# Altium schematic sheet Sheet1.SchDoc (part 2 of 2)
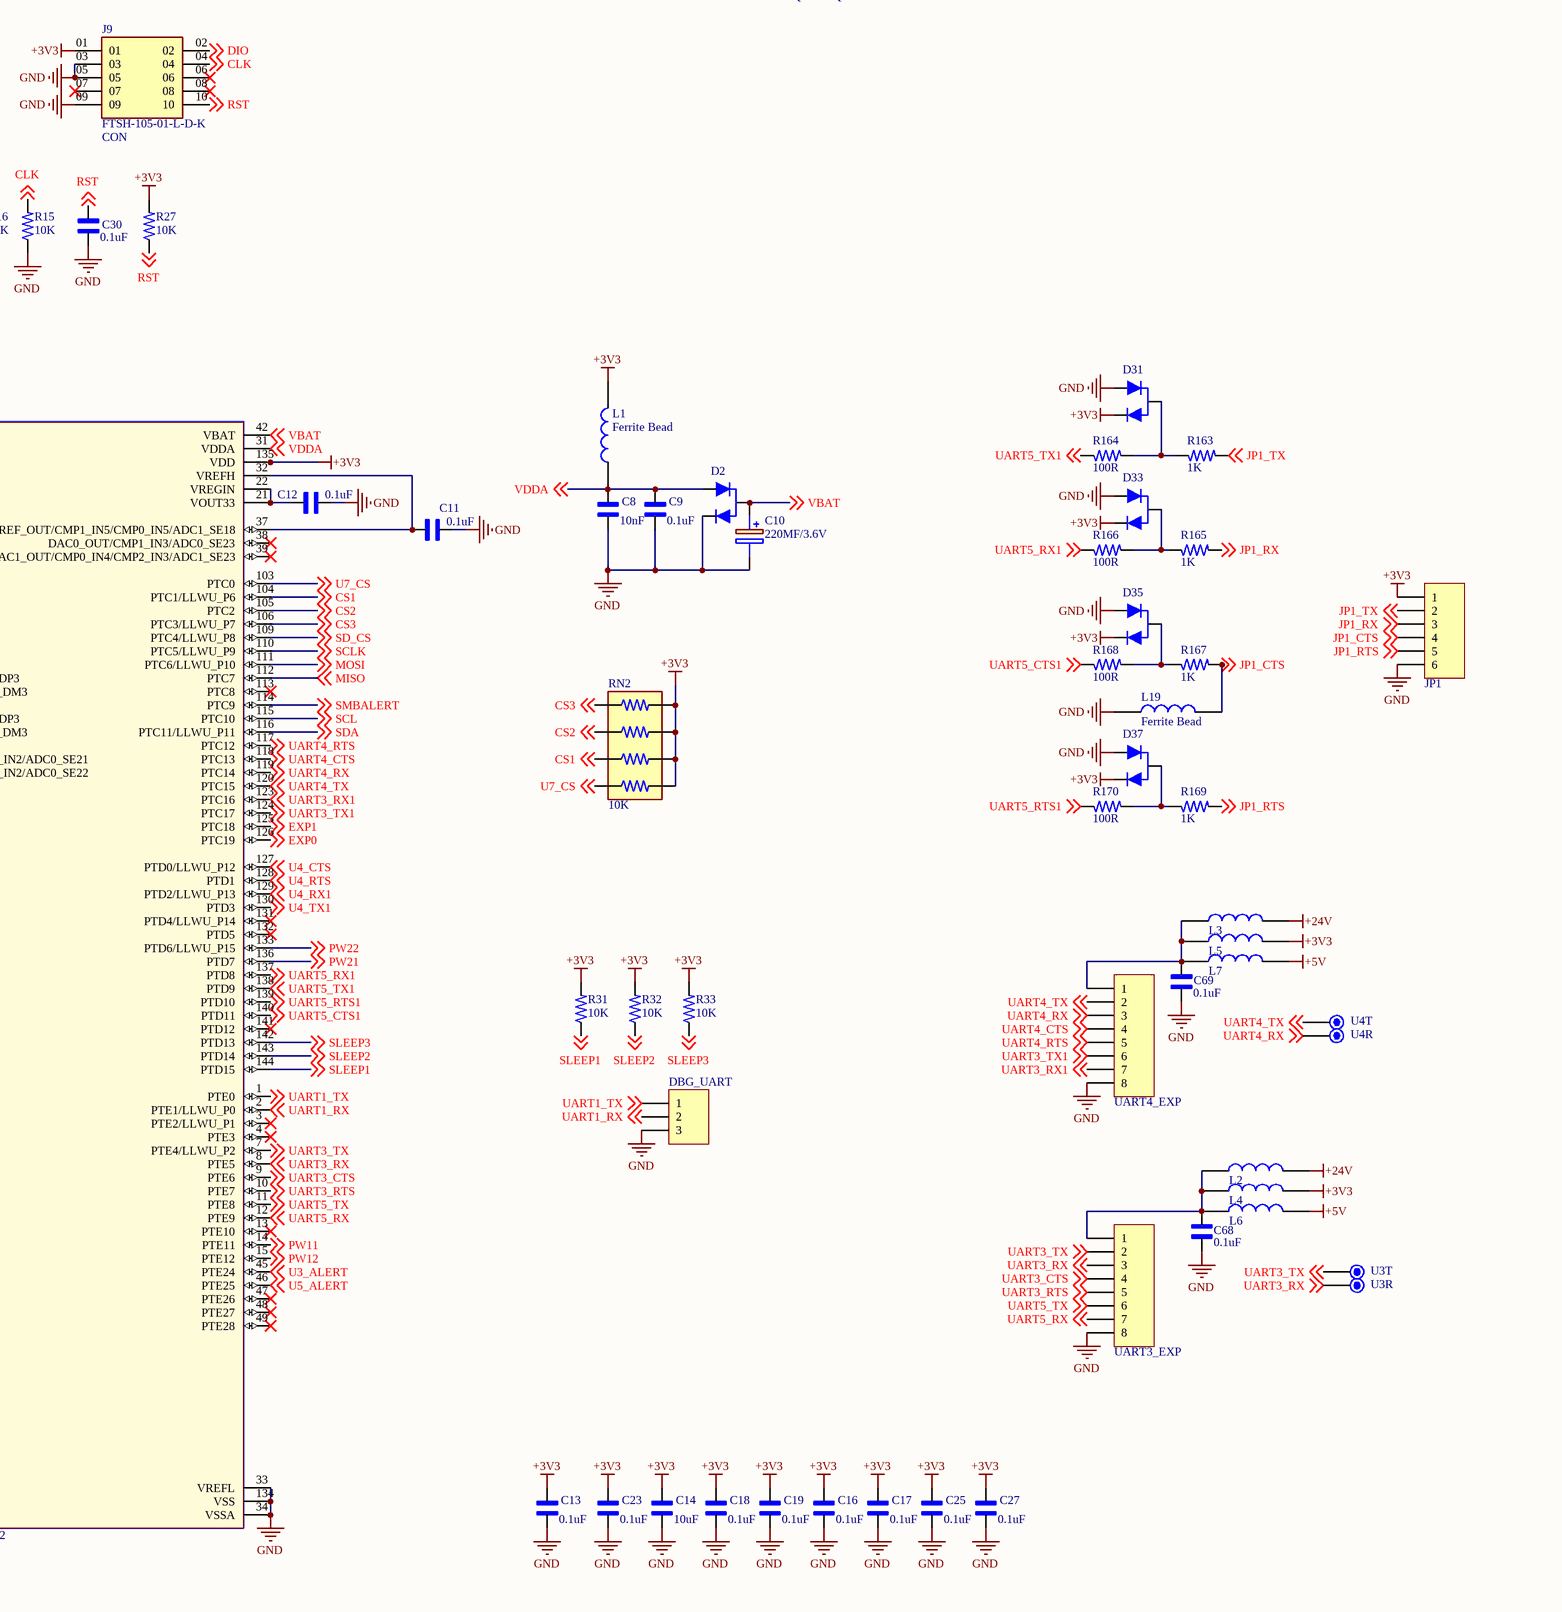
[diagram p6: Sheet1.SchDoc, bottom right]

## Library data of the parts
3V3_IN 5V_IN BUZ P1 P2 = 68000-102HLF: Header, 2-Pin, 2.54mm, male; MF: Amphenol ICC (FCI); Value: 2 pin CON; Datasheet-Link: https://cdn.amphenol-icc.com/media/wysiwyg/files/drawing/68000.pdf?__cf_chl_jschl_tk__=7ea4d2e6d26f4b1af1eb6de445b76fab93bb47dd-1595041825-0-ASnK1FzhPW6vgFI15XYUBUXEwCrSO2dXE6hJ2i7nK7EmHy2IXrw8kXy-yQAUmCnBmIw7fq0tDTrhRSGBjDko3p2cIf_9_6cWkOxKpupqnp2oo8Mh8aWH2eb6ujii_TwFn-8V86_rmivQvUxavIUAiOIBYcm3LlQezqcHHzAaCpgu7miW4qxavRXA3YsY5ejAoH67-z-iVxDQ5Sra6f0EFF9zE8XIxAld420ntFklNg4QF76eftiKB7TEYUxSsn8LfartoqNYBWmHHnD3sc-tmz73YWEHN4X2dyLz7kl35vb2-QvBMSr1BL4MKNiQX7UeGfn1P3DlF5qPDRur16CMA0NTN9g-uagsfIoYsnwBgv65CCZM2V9dKSS6CJzKDs8ifA; DigiKey-Link: https://www.digikey.com.au/product-detail/en/amphenol-icc-fci/68000-102HLF/609-3500-ND/1493545; Datasheet: 68000; DigiKey-PartNum: 609-3500-ND; MP: 68000-102HLF; Price: 0.21
C3-C8 C15 C70-C77 C104 C111 C154 = 08055C103KAT2A: CAP CER 10000PF 50V X7R 0805; MF: AVX Corporation; DigiKey-Link: https://www.digikey.com/en/products/detail/avx-corporation/08055C103KAT2A/563493?s=N4IgTCBcDaIAwA44FZkGECMcDMBpAggCpj4gC6AvkA; MP: 08055C103KAT2A; Datasheet-Link: https://datasheets.avx.com/X7RDielectric.pdf; DigiKey-PartNum: 478-1383-2-ND; Price: 0.1; Datasheet: X7RDielectric.pdf
  C3 C70-C77: Value: ?
C9 C11-C13 C16-C19 C23 C25 C27-C30 C33 C35 C37 C41-C43 C48-C50 C61 C63 C68 C69 C86 C101 C108 C114 C123 C124 C136 C139-C145 C147 C149 C153 C155 = 0805B104K500CT: 0.1µF ±10% 50V Ceramic Capacitor X7R 0805 (2012 Metric); MF: Walsin Technology Corporation; DigiKey-Link: https://www.digikey.com/en/products/detail/walsin-technology-corporation/0805B104K500CT/6707556?s=N4IgTCBcDaIAwA44FYBCBGOAWA0sucAwgCogC6AvkA; MP: 0805B104K500CT; Datasheet-Link: http://www.passivecomponent.com/wp-content/uploads/2018/10/MLCC.pdf; DigiKey-PartNum: 1292-1647-2-ND; Price: 0.12; Datasheet: MLCC.pdf
C10 = EEC-RG0V224H: CAP 220MF -20% +80% 3.6V T/H; MF: Panasonic Electronic Components; Datasheet-Link: https://media.digikey.com/pdf/Data%20Sheets/Panasonic%20Electronic%20Components/RG_Series.pdf; DigiKey-PartNum: P14880-ND; DigiKey-Link: https://www.digikey.com/en/products/detail/panasonic-electronic-components/EEC-RG0V224H/2689238; MP: EEC-RG0V224H; Price: 2.8748; Datasheet: RG_Series.pdf
C14 C34 C105 C125 = GRM21BR61E106KA73L: CAP CER 10UF 25V X5R 0805; MF: Murata Electronics; DigiKey-Link: https://www.digikey.com/en/products/detail/murata-electronics/GRM21BR61E106KA73L/2334874?s=N4IgTCBcDaIOICUCyYCMAhBA2VBRVADFgNICCA7AMwAyIAugL5A; MP: GRM21BR61E106KA73L; Datasheet-Link: https://search.murata.co.jp/Ceramy/image/img/A01X/G101/ENG/GRM21BR61E106KA73-01.pdf; DigiKey-PartNum: 490-5523-2-ND; Price: 0.42; Datasheet: GRM21BR61E106KA73-01.pdf
C20 C24 = 0805N180J500CT: Multilayer Ceramic Capacitors MLCC - SMD/SMT 18pF +-5% 50V; MF: Walsin; DigiKey-Link: https://www.mouser.com/ProductDetail/Walsin/0805N180J500CT?qs=%2Fha2pyFaduikWgGfsiYRtP7oZXvD9xcHAcsFmv7pQ5dIAkGrZOp47g%3D%3D; MP: 0805N180J500CT; Datasheet-Link: https://www.mouser.com/datasheet/2/210/WTC_MLCC_General_Purpose-1534899.pdf; DigiKey-PartNum: 791-0805N180J500CT; Price: 0.1; Datasheet: WTC_MLCC_General_Purpose-1534899.pdf
C21 C22 = 0805N120J500CT: Multilayer Ceramic Capacitors MLCC - SMD/SMT 12pF +-5% 50V; MF: Walsin; DigiKey-Link: https://www.mouser.com/ProductDetail/Walsin/0805N120J500CT?qs=ZrPdAQfJ6DNl6F0w1DXt8g%3D%3D; MP: 0805N120J500CT; Datasheet-Link: https://www.mouser.com/datasheet/2/210/WTC_MLCC_General_Purpose-1534899.pdf; DigiKey-PartNum: 791-0805N120J500CT; Price: 0.1; Datasheet: WTC_MLCC_General_Purpose-1534899.pdf
C38-C40 C106 C109 C110 C126-C135 C146 C148 = GRM32ER71H106KA12L: CAP CER 10UF 50V X7R 1210; MF: Murata Electronics; DigiKey-Link: https://www.digikey.com/en/products/detail/murata-electronics/GRM32ER71H106KA12L/2548481?s=N4IgTCBcDaIOICUCyBmMBRBB2AjACRwAYA2AaQEEcwAZEAXQF8g; MP: GRM32ER71H106KA12L; Datasheet-Link: https://www.murata.com/-/media/webrenewal/support/library/catalog/products/capacitor/ceramiccapacitor/c02e.ashx?la=en-us&cvid=20210120024548000000; DigiKey-PartNum: 490-6544-2-ND; Price: 0.49128; Datasheet: c02e
C44-C47 C51-C55 C121 = 08055C105KAT2A: CAP CER 1UF 50V X7R 0805; MF: AVX Corporation; DigiKey-Link: https://www.digikey.com/en/products/detail/avx-corporation/08055C105KAT2A/3081236?s=N4IgTCBcDaIAwA44FZkGECMKDSBBAKmLiALoC%2BQA; Datasheet-Link: https://datasheets.avx.com/X7RDielectric.pdf; Price: 0.38; MP: 08055C105KAT2A; DigiKey-PartNum: 478-7956-2-ND; Datasheet: X7RDielectric.pdf
C56-C59 C115 C118 = 08055C102KAT4A: CAP CER 1000PF 50V X7R 0805; MF: AVX Corporation; DigiKey-Link: https://www.digikey.com/en/products/detail/avx-corporation/08055C102KAT4A/1635067?s=N4IgTCBcDaIAwA44FZkGECMcwGkCCAKgCx4gC6AvkA; MP: 08055C102KAT4A; Datasheet-Link: https://datasheets.avx.com/X7RDielectric.pdf; DigiKey-PartNum: 08055C102KAT4A-ND; Price: 0.01379; Datasheet: X7RDielectric.pdf
C60 C62 C64-C67 = ESH477M050AH4AA: CAP ALUM 470UF 20% 50V THRU HOLE; MF: KEMET; Datasheet-Link: https://content.kemet.com/datasheets/KEM_A4005_ESH.pdf; DigiKey-PartNum: 399-15683-ND; DigiKey-Link: https://www.digikey.com/en/products/detail/kemet/ESH477M050AH4AA/7423189?s=N4IgTCBcDaIKIGUASAWA7GgsgBgKzYEFUCCQBdAXyA; MP: ESH477M050AH4AA; Price: 0.59; Datasheet: KEM_A4005_ESH.pdf
C107 = VJ0805A101JXAAC: CAP CER 100PF 50V C0G/NP0 0805; MF: Vishay Vitramon; MP: VJ0805A101JXAAC; DigiKey-Link: https://www.digikey.com/en/products/detail/vishay-vitramon/VJ0805A101JXAAC/8306970?s=N4IgTCBcDaIGoCkAMAOJBWAggRidhAGppgMIgC6AvkA; Datasheet-Link: https://www.vishay.com/docs/45199/vjcommercialseries.pdf; DigiKey-PartNum: 720-1840-2-ND; Price: 0.33; Datasheet: vjcommercialseries.pdf
C112 = UMK212B7224KG-T: CAP CER 0.22UF 50V X7R 0805; MF: Taiyo Yuden; DigiKey-Link: https://www.digikey.com/en/products/detail/taiyo-yuden/UMK212B7224KG-T/930639?s=N4IgTCBcDaIKoFkDSYCMYBCB2MYAsSA4gLQAqIAugL5A; Datasheet-Link: https://www.yuden.co.jp/productdata/catalog/mlcc06_e.pdf; Price: 0.15; MP: UMK212B7224KG-T; DigiKey-PartNum: 587-1287-2-ND; Datasheet: mlcc06_e.pdf
C113 C150 = GRM21BR60J226ME39L: CAP CER 22UF 6.3V X5R 0805; MF: Murata Electronics; DigiKey-Link: https://www.digikey.com/en/products/detail/murata-electronics/GRM21BR60J226ME39L/586711?s=N4IgTCBcDaIOICUCyYCMAhBA2ADAKTDCyQFEBmATgBkQBdAXyA; MP: GRM21BR60J226ME39L; Datasheet-Link: https://search.murata.co.jp/Ceramy/image/img/A01X/G101/ENG/GRM21BR60J226ME39-01.pdf; DigiKey-PartNum: 490-1719-2-ND; Price: 0.45; Datasheet: GRM21BR60J226ME39-01.pdf
C116 = CC0805ZRY5V9BB474: CAP CER 0.47UF 50V Y5V 0805; MF: Yageo; DigiKey-Link: https://www.digikey.com/en/products/detail/yageo/CC0805ZRY5V9BB474/5884321?s=N4IgTCBcDaIMJwAwA5EFYBaAlAmmgagJwBCxALAOxkgC6AvkA; Datasheet-Link: https://www.yageo.com/upload/media/product/productsearch/datasheet/mlcc/UPY-GPHC_Y5V_6.3V-to-50V_9.pdf; Price: 0.21; MP: CC0805ZRY5V9BB474; DigiKey-PartNum: 311-4365-2-ND; Datasheet: UPY-GPHC_Y5V_6.3V-to-50V_9.pdf
C117 C122 = VJ0805V334MXACW1BC: CAP CER 0.33UF 50V Y5V 0805; MF: Vishay Vitramon; MP: VJ0805V334MXACW1BC; DigiKey-Link: https://www.digikey.com/en/products/detail/vishay-vitramon/VJ0805V334MXACW1BC/8310675?s=N4IgTCBcDaIGoCkAMAOJBWOBmLAWAsgBoCCAwgOoCMAQqSALoC%2BQA; Datasheet-Link: https://www.vishay.com/docs/28548/vjw1bcbascomseries.pdf; DigiKey-PartNum: VJ0805V334MXACW1BC-ND; Price: 0.17017; Datasheet: vjw1bcbascomseries.pdf
C119 = C1206C104M5RACTU: CAP CER 0.1UF 50V X7R 1206; MF: KEMET; DigiKey-Link: https://www.digikey.com/en/products/detail/kemet/C1206C104M5RACTU/411247?s=N4IgTCBcDaIMIEYwAYBsjkBYCyBWASgIJwAqAqiALoC%2BQA; Price: 0.12; Datasheet-Link: https://content.kemet.com/datasheets/KEM_C1002_X7R_SMD.pdf; MP: C1206C104M5RACTU; Package: 1206 KEMET; DigiKey-PartNum: 399-1248-2-ND; Datasheet: KEM_C1002_X7R_SMD.pdf
C120 = UMK212BB7225KG-T: CAP CER 2.2UF 50V X7R 0805; MF: Taiyo Yuden; DigiKey-Link: https://www.digikey.com/en/products/detail/taiyo-yuden/UMK212BB7225KG-T/3194965?s=N4IgTCBcDaIKoFkDSYCMYBCGDsYwFYkBxAWgBUQBdAXyA; Datasheet-Link: https://www.yuden.co.jp/productdata/catalog/mlcc06_e.pdf; Price: 0.36; MP: UMK212BB7225KG-T; DigiKey-PartNum: 587-3169-2-ND; Datasheet: mlcc06_e.pdf
C137 = 860020675017: CAP ALUM 120UF 20% 50V RADIAL; MF: Würth Elektronik; Datasheet-Link: https://www.we-online.de/katalog/datasheet/860020675017.pdf; DigiKey-PartNum: 732-8863-1-ND; DigiKey-Link: https://www.digikey.com/en/products/detail/w%C3%BCrth-elektronik/860020675017/5728808?s=N4IgTCBcDaIBwDYAMSxIQdgKxIIwZAF0BfIA; MP: 860020675017; Price: 0.35; Datasheet: 860020675017.pdf
C138 = 1206X226K160CT: Multilayer Ceramic Capacitors MLCC - SMD/SMT 1206 MLCC X5R 22 uF +/ -10% 16 V T&R GP; MF: Walsin; DigiKey-Link: https://www.mouser.com/ProductDetail/Walsin/1206X226K160CT?qs=%2Fha2pyFadugVtaQvFA9oTf6iHp56C%252BCWnsDB92qB02DUsEZR1zEjqw%3D%3D; MP: 1206X226K160CT; Datasheet-Link: https://www.mouser.com/datasheet/2/210/WTC_MLCC_General_Purpose-1534899.pdf; DigiKey-PartNum: 791-1206X226K160CT; Price: 0.76; Datasheet: WTC_MLCC_General_Purpose-1534899.pdf
D2 = BAS40-04E6327: BAS40 - HIGH SPEED SWITCHING, CL; MF: Infineon Technologies; Datasheet-Link: https://www.mouser.com/datasheet/2/196/bas40_bas140series-60208.pdf; Value: BAS40-04E6327; DigiKey-PartNum: 2156-BAS40-04E6327-ND; MP: BAS40-04E6327; DigiKey-Link: https://www.digikey.com/en/products/detail/infineon-technologies/BAS40-04E6327/13431907; Price: 0.05; Datasheet: bas40_bas140series-60208.pdf
D3-D6 D15-D22 D31 D33 D35 D37 = BAT54S,215: DIODE ARRAY SCHOTTKY 30V SOT23; MF: Nexperia USA Inc.; Datasheet-Link: https://assets.nexperia.com/documents/data-sheet/BAT54_SER.pdf; Value: BAT54S,215; DigiKey-PartNum: 1727-2904-2-ND; MP: BAT54S,215; DigiKey-Link: https://www.digikey.com/en/products/detail/nexperia-usa-inc/BAT54S-215/763218; Price: 0.13; Datasheet: BAT54_SER.pdf
D7 D8 D23-D26 = BAS40-06: SCHOTTKY SOT-23 40V 0.2A; MF: Diotec Semiconductor; Datasheet-Link: https://diotec.com/tl_files/diotec/files/pdf/datasheets/bas40.pdf; Value: BAS40-06; DigiKey-PartNum: 2796-BAS40-06TR-ND; MP: BAS40-06; DigiKey-Link: https://www.digikey.com/en/products/detail/diotec-semiconductor/BAS40-06/13156765; Price: 0.0319; Datasheet: bas40.pdf
D9-D14 = SMLJ43CA: TVS DIODE 43V 69.4V SMC; MF: Bourns Inc.; Datasheet-Link: https://www.bourns.com/docs/Product-Datasheets/SMLJ.pdf; Value: SMLJ43CA; DigiKey-PartNum: SMLJ43CABTR-ND; MP: SMLJ43CA; DigiKey-Link: https://www.digikey.com/en/products/detail/bourns-inc/SMLJ43CA/2253506; Price: 1.23; Datasheet: SMLJ.pdf
D27 D29 D40 = BZX384-B15,115: DIODE ZENER 15V 300MW SOD323; MF: Nexperia USA Inc.; Datasheet-Link: https://assets.nexperia.com/documents/data-sheet/BZX384_SERIES.pdf; Value: BZX384-B15,115; DigiKey-PartNum: 1727-3640-2-ND; MP: BZX384-B15,115; DigiKey-Link: https://www.digikey.com/en/products/detail/nexperia-usa-inc/BZX384-B15-115/1162898?s=N4IgTCBcDaIEIC0AaBmAHAFgLRwIwFYAaXAkAXQF8g; Price: 0.19; Datasheet: BZX384_SERIES.pdf
D28 D32 = SMAJ43A-E3/61: TVS DIODE 43V 69.4V DO214AC; MF: Vishay General Semiconductor - Diodes Division; Datasheet-Link: https://www.vishay.com/docs/88390/smaj50a.pdf; Value: SMAJ43A-E3/61; DigiKey-PartNum: SMAJ43A-E3/61GITR-ND; MP: SMAJ43A-E3/61; DigiKey-Link: https://www.digikey.com/en/products/detail/vishay-general-semiconductor-diodes-division/SMAJ43A-E3-61/1119136?s=N4IgTCBcDaIMoFkCCApALAZiQWgKIYHoA2ARhAF0BfIA; Price: 0.4; Datasheet: smaj50a.pdf
D30 D36 D38 = 1N4148WS-7-F: Diode Standard 75V 150mA Surface Mount SOD-323; MF: Diodes Incorporated; Datasheet-Link: https://www.diodes.com/assets/Datasheets/ds30097.pdf; Value: 1N4148WS-7-F; DigiKey-PartNum: 1N4148WS-FDITR-ND; MP: 1N4148WS-7-F; DigiKey-Link: https://www.digikey.com.au/product-detail/en/diodes-incorporated/1N4148WS-7-F/1N4148WS-FDITR-ND/815127; Price: 0.03166; Datasheet: ds30097
D34 D39 = MBRD20100CT-13: DIODE SCHOTTKY 100V 10A TO252; MF: Diodes Incorporated; Datasheet-Link: https://www.diodes.com/assets/Datasheets/MBRD20100CT.pdf; Value: MBRD20100CT-13; DigiKey-PartNum: MBRD20100CT-13DITR-ND; MP: MBRD20100CT-13; DigiKey-Link: https://www.digikey.com/en/products/detail/diodes-incorporated/MBRD20100CT-13/5080339?s=N4IgTCBcDaILICEBKARMAGAjO9BhAKgLSYDMIAugL5A; Price: 0.64; Datasheet: MBRD20100CT.pdf
DBG_UART = 68000-103HLF: Header, 3-Pin, 2.54mm, male; MF: Amphenol ICC (FCI); Value: 3pin CON; Datasheet: 68000; Datasheet-Link: https://cdn.amphenol-icc.com/media/wysiwyg/files/drawing/68000.pdf?__cf_chl_jschl_tk__=7ea4d2e6d26f4b1af1eb6de445b76fab93bb47dd-1595041825-0-ASnK1FzhPW6vgFI15XYUBUXEwCrSO2dXE6hJ2i7nK7EmHy2IXrw8kXy-yQAUmCnBmIw7fq0tDTrhRSGBjDko3p2cIf_9_6cWkOxKpupqnp2oo8Mh8aWH2eb6ujii_TwFn-8V86_rmivQvUxavIUAiOIBYcm3LlQezqcHHzAaCpgu7miW4qxavRXA3YsY5ejAoH67-z-iVxDQ5Sra6f0EFF9zE8XIxAld420ntFklNg4QF76eftiKB7TEYUxSsn8LfartoqNYBWmHHnD3sc-tmz73YWEHN4X2dyLz7kl35vb2-QvBMSr1BL4MKNiQX7UeGfn1P3DlF5qPDRur16CMA0NTN9g-uagsfIoYsnwBgv65CCZM2V9dKSS6CJzKDs8ifA; DigiKey-Link: https://www.digikey.com.au/product-detail/en/amphenol-icc-fci/68000-103HLF/609-3461-ND/2023309; DigiKey-PartNum: 609-3461-ND; MP: 68000-103HLF; Price: 0.3
ENC_1 ENC_2 JP4 = 68000-104HLF: Connector Header Through Hole 4 position 0.100" (2.54mm); MF: Amphenol ICC (FCI); Value: 4pin CON; Datasheet: 68000; Datasheet-Link: https://cdn.amphenol-icc.com/media/wysiwyg/files/drawing/68000.pdf?__cf_chl_jschl_tk__=7ea4d2e6d26f4b1af1eb6de445b76fab93bb47dd-1595041825-0-ASnK1FzhPW6vgFI15XYUBUXEwCrSO2dXE6hJ2i7nK7EmHy2IXrw8kXy-yQAUmCnBmIw7fq0tDTrhRSGBjDko3p2cIf_9_6cWkOxKpupqnp2oo8Mh8aWH2eb6ujii_TwFn-8V86_rmivQvUxavIUAiOIBYcm3LlQezqcHHzAaCpgu7miW4qxavRXA3YsY5ejAoH67-z-iVxDQ5Sra6f0EFF9zE8XIxAld420ntFklNg4QF76eftiKB7TEYUxSsn8LfartoqNYBWmHHnD3sc-tmz73YWEHN4X2dyLz7kl35vb2-QvBMSr1BL4MKNiQX7UeGfn1P3DlF5qPDRur16CMA0NTN9g-uagsfIoYsnwBgv65CCZM2V9dKSS6CJzKDs8ifA; DigiKey-Link: https://www.digikey.com.au/products/en?keywords=68000-104HLF; DigiKey-PartNum: 609-3248-ND; MP: 68000-104HLF; Price: 0.35
F1 F2 = C3130: 5x20 Fuse Holders RoHS; MF: Xucheng Elec; Datasheet-Link: https://datasheet.lcsc.com/lcsc/2012041637_Xucheng-Elec-C3130_C3130.pdf; DigiKey-PartNum: C3130; DigiKey-Link: https://lcsc.com/product-detail/Fuse-Holders_Xucheng-Elec-C3130_C3130.html; MP: C3130; Price: 0.0241; Datasheet: 2012041637_Xucheng-Elec-C3130_C3130.pdf
GPIO_EXP UART3_EXP UART4_EXP = 68001-108HLF: Header, 8-Pin, 2.54mm, male; MF: Amphenol ICC (FCI); Datasheet: 68000; Datasheet-Link: https://cdn.amphenol-icc.com/media/wysiwyg/files/drawing/68000.pdf?__cf_chl_jschl_tk__=7ea4d2e6d26f4b1af1eb6de445b76fab93bb47dd-1595041825-0-ASnK1FzhPW6vgFI15XYUBUXEwCrSO2dXE6hJ2i7nK7EmHy2IXrw8kXy-yQAUmCnBmIw7fq0tDTrhRSGBjDko3p2cIf_9_6cWkOxKpupqnp2oo8Mh8aWH2eb6ujii_TwFn-8V86_rmivQvUxavIUAiOIBYcm3LlQezqcHHzAaCpgu7miW4qxavRXA3YsY5ejAoH67-z-iVxDQ5Sra6f0EFF9zE8XIxAld420ntFklNg4QF76eftiKB7TEYUxSsn8LfartoqNYBWmHHnD3sc-tmz73YWEHN4X2dyLz7kl35vb2-QvBMSr1BL4MKNiQX7UeGfn1P3DlF5qPDRur16CMA0NTN9g-uagsfIoYsnwBgv65CCZM2V9dKSS6CJzKDs8ifA; DigiKey-Link: https://www.digikey.com.au/product-detail/en/amphenol-icc-fci/68001-108HLF/609-3273-ND/1878534; DigiKey-PartNum: 609-3273-ND; MP: 68001-108HLF; Price: 0.5; Value: 68001-108HLF
IC1 = LMV321IDBVR: General Purpose Amplifier Circuit Rail-to-Rail SOT-23-5; MF: Texas Instruments; Package: SOT-23-5 Texas Instruments; Datasheet: slos263w; Value: LMV321IDBVR; MP: LMV321IDBVR; DigiKey-PartNum: 296-9567-2-ND; Price: 0.7; DigiKey-Link: https://www.digikey.com/en/products/detail/texas-instruments/LMV321IDBVR/381311; Datasheet-Link: https://rocelec.widen.net/view/pdf/hsbslfymvc/slos263w.pdf?t.download=true&u=5oefqw
IC3-IC9 = BSC360N15NS3 G: MOSFET N-Ch 150V 33A TDSON-8 OptiMOS 3; MF: Infineon Technologies; Value: BSC360N15NS3 G; DigiKey-Link: https://www.mouser.com/ProductDetail/Infineon-Technologies/BSC360N15NS3-G?qs=%2Fha2pyFaduiCq8VAM1Mkh6CcM9gP2HQoA5QmRxYwdjBpvIA4eu8o3w%3D%3D; Datasheet-Link: https://www.mouser.com/datasheet/2/196/BSC360N15NS3_Rev2.0-75853.pdf; Price: 1.7; MP: BSC360N15NS3 G; DigiKey-PartNum: 726-BSC360N15NS3G; ComponentLink1Description: Manufacturer Link; ComponentLink1URL: http://www.irf.com/; Datasheet: BSC360N15NS3_Rev2.0-75853.pdf
J2 J8 J10-J12 J14-J20 J22-J24 J26 J27 = 62409-1: Faston 20-16 AWG Straight Non-Insulated Printed Circuit Board Tab Terminal   Pitch  0.250 SOLDER; MF: TE Connectivity AMP Connectors; Value: 62409-1; DigiKey-PartNum: A24742-ND; Datasheet: ENG_CD_62409_S_baseFilename.pdf; Price: 0.19; DigiKey-Link: https://www.digikey.com/en/products/detail/te-connectivity-amp-connectors/62409-1/290409; Datasheet-Link: https://www.te.com/commerce/DocumentDelivery/DDEController?Action=srchrtrv&DocNm=62409&DocType=Customer+Drawing&DocLang=English; MP: 62409-1
J9 = FTSH-105-01-L-D-K: Connector Header Through Hole 10 position 0.050" (1.27mm); MF: Samtec; Price: 3.69; MP: FTSH-105-01-L-D-K; Datasheet: ftsh_th.pdf; Datasheet-Link: http://suddendocs.samtec.com/catalog_english/ftsh_th.pdf; DigiKey-Link: https://www.digikey.com/en/products/detail/samtec-inc/FTSH-105-01-L-D-K/2649979?s=N4IgTCBcDaIGIBUDKAJAtARgAwFY1YzQBk0ARNAaRAF0BfIA; DigiKey-PartNum: SAM8798-ND
J28 = DM3AT-SF-PEJM5: 10 (8 + 2) Position Card Connector Secure Digital - microSD™ Surface Mount, Right Angle Gold; MF: Hirose; Price: 2.5; Datasheet-Link: https://www.hirose.com/product/document?clcode=CL0609-0033-6-00&productname=DM3AT-SF-PEJ2M5&series=DM3&documenttype=Catalog&lang=en&documentid=D49662_en; Datasheet: ed_DM3_20190621.pdf; MP: DM3AT-SF-PEJM5; DigiKey-Link: https://www.digikey.com/en/products/detail/hirose-electric-co-ltd/DM3AT-SF-PEJM5/2533565; DigiKey-PartNum: HR1964TR-ND
JP1 = 68000-106HLF: Connector Header Through Hole 6 position 0.100" (2.54mm); MF: Amphenol ICC (FCI); Datasheet: 68000; Datasheet-Link: https://cdn.amphenol-icc.com/media/wysiwyg/files/drawing/68000.pdf?__cf_chl_jschl_tk__=7ea4d2e6d26f4b1af1eb6de445b76fab93bb47dd-1595041825-0-ASnK1FzhPW6vgFI15XYUBUXEwCrSO2dXE6hJ2i7nK7EmHy2IXrw8kXy-yQAUmCnBmIw7fq0tDTrhRSGBjDko3p2cIf_9_6cWkOxKpupqnp2oo8Mh8aWH2eb6ujii_TwFn-8V86_rmivQvUxavIUAiOIBYcm3LlQezqcHHzAaCpgu7miW4qxavRXA3YsY5ejAoH67-z-iVxDQ5Sra6f0EFF9zE8XIxAld420ntFklNg4QF76eftiKB7TEYUxSsn8LfartoqNYBWmHHnD3sc-tmz73YWEHN4X2dyLz7kl35vb2-QvBMSr1BL4MKNiQX7UeGfn1P3DlF5qPDRur16CMA0NTN9g-uagsfIoYsnwBgv65CCZM2V9dKSS6CJzKDs8ifA; DigiKey-Link: digikey.com.au/products/en?keywords=68000-106HLF; DigiKey-PartNum: 609-3249-ND; MP: 68000-106HLF; Price: 0.46; Value: 68000-106HLF
JP2 = 68000-105HLF: Connector Header Through Hole 5 position 0.100" (2.54mm); MF: Amphenol ICC (FCI); Value: 5pin CON; Datasheet: 68000; Datasheet-Link: https://cdn.amphenol-icc.com/media/wysiwyg/files/drawing/68000.pdf?__cf_chl_jschl_tk__=7ea4d2e6d26f4b1af1eb6de445b76fab93bb47dd-1595041825-0-ASnK1FzhPW6vgFI15XYUBUXEwCrSO2dXE6hJ2i7nK7EmHy2IXrw8kXy-yQAUmCnBmIw7fq0tDTrhRSGBjDko3p2cIf_9_6cWkOxKpupqnp2oo8Mh8aWH2eb6ujii_TwFn-8V86_rmivQvUxavIUAiOIBYcm3LlQezqcHHzAaCpgu7miW4qxavRXA3YsY5ejAoH67-z-iVxDQ5Sra6f0EFF9zE8XIxAld420ntFklNg4QF76eftiKB7TEYUxSsn8LfartoqNYBWmHHnD3sc-tmz73YWEHN4X2dyLz7kl35vb2-QvBMSr1BL4MKNiQX7UeGfn1P3DlF5qPDRur16CMA0NTN9g-uagsfIoYsnwBgv65CCZM2V9dKSS6CJzKDs8ifA; DigiKey-Link: https://www.digikey.com/en/products/detail/amphenol-icc-fci/68000-105HLF/2023304?s=N4IgTCBcDaIGwA4AMKC0BGJBWAEgGQDEQBdAXyA; DigiKey-PartNum: 609-3462-ND; MP: 68000-105HLF; Price: 0.41
JP3 JP5-JP7 = PH1-01-UA: Connector Header Through Hole 1 position 0.100" (2.54mm); MF: Adam Tech; Datasheet: PH1-XX-UA; Datasheet-Link: https://www.alldatasheet.com/datasheet-pdf/pdf/849534/ADAM-TECH/PH1-XX-UA.html; DigiKey-Link: https://www.digikey.com.au/product-detail/en/adam-tech/PH1-01-UA/2057-PH1-01-UA-ND/9830231; DigiKey-PartNum: 2057-PH1-01-UA-ND; MP: PH1-01-UA; Price: 0.1; Value: PH1-01-UA
K1 = HFE20-1/5-1HST-L2(257): HFE20 Series 5 V 5 mm Pin 1 FORM A Sealed Miniature Dual Coil Latching Relay; MF: Hongfa; DigiKey-Link: https://www.futureelectronics.com/p/electromechanical--relays--power-relays/hfe20-1-5-1hst-l2-257-hongfa-8060061; Datasheet-Link: http://www.hongfaamerica.com/hq/PDF/HFE20_en.pdf; Height: 16.3mm; MP: HFE20-1/5-1HST-L2(257); DigiKey-PartNum: HFE20-1/5-1HST-L2(257); Price: 3.03593; Datasheet: HFE20_en.pdf; Value: HFE20-1/5-1HST-L2(257)
L1-L7 L17 L19 = BK2125HS601-T: - Ferrite Bead 0805 (2012 Metric) 500mA 300mOhm; MF: Taiyo Yuden; Datasheet-Link: https://www.yuden.co.jp/productdata/catalog/mlci07_e.pdf; MP: BK2125HS601-T; DigiKey-Link: https://www.digikey.com/en/products/detail/taiyo-yuden/BK2125HS601-T/957813; DigiKey-PartNum: 587-1912-2-ND; Price: 0.11; Datasheet: mlci07_e.pdf
  L2-L7 L17: Value: Ferrite Bead
L10 = XAL1010-103MEB: Fixed Inductors 10uH Shld 20% 15.5A 14.75mOhms AECQ2; MF: COILCRAFT; Datasheet: xal1010-270716.pdf; Datasheet-Link: https://componentsearchengine.com//XAL1010-103MEB.pdf; Height: 10mm; DigiKey-Link: https://www.mouser.com/ProductDetail/Coilcraft/XAL1010-103MEB?qs=VJjuEbE9QBO9gKZmLXl36Q%3D%3D; DigiKey-PartNum: 994-XAL1010-103MEB; MP: XAL1010-103MEB; Price: 5.25; Value: XAL1010-103MEB
L12 L13 = SRN6045-150M: FIXED IND 15UH 1.9A 95.8MOHM SMD; MF: Bourns Inc.; DigiKey-PartNum: SRN6045-150MTR-ND; MP: SRN6045-150M; DigiKey-Link: https://www.digikey.com/en/products/detail/bourns-inc/SRN6045-150M/2756121?s=N4IgTCBcDaIMoCUByA2ADAFgKwFoCMWaAsiALoC%2BQA; Datasheet-Link: https://www.bourns.com/docs/Product-Datasheets/SRN6045.pdf; Price: 0.73600; Datasheet: srn6045.pdf
LED1-LED5 LED7-LED10 LED13-LED15 = EL-17-21SURC/S530-A2/TR8: Standard LEDs - SMD Red Water Clear 624nm 42mcd; MF: Everlight; DigiKey-Link: https://www.mouser.com/ProductDetail/Everlight/EL-17-21SURC-S530-A2-TR8?qs=%2Fha2pyFadujB6Z9ygPWpJ4Sq6tFqWc6rNgScvBfvoSI9tOUz7DsI2PewXYBjytBn; Datasheet-Link: https://media.digikey.com/pdf/Data%20Sheets/Everlight%20PDFs/17-21SURC-S530-A2-TR8-V5~.pdf; Price: 0.031; MP: EL-17-21SURC/S530-A2/TR8; DigiKey-PartNum: 638-172SURCS530-A2; Datasheet: 17-21SURC-S530-A2-TR8-V5_.pdf
PW11 PW12 PW21 PW22 PW31 PW32 U2R1 U2T1 U3R U3T U4R U4T V_BRIDGE V_BUT = E_PAD(SMD)
Q1 = CRGCQ0603F390K
Q2-Q7 = PDTC114ET,215: TRANS PREBIAS NPN 250MW TO236AB; MF: Nexperia USA Inc.; Datasheet-Link: https://assets.nexperia.com/documents/data-sheet/PDTC114E_SER.pdf; Value: PDTC114ET,215; DigiKey-PartNum: 1727-5131-2-ND; MP: PDTC114ET,215; DigiKey-Link: https://www.digikey.com/en/products/detail/nexperia-usa-inc/PDTC114ET-215/1157277; Price: 0.16; Datasheet: PDTC114E_SER.pdf
Q8 Q10 Q14 = BC847B-7-F: TRANS NPN 45V 0.1A SOT23-3; MF: Diodes Incorporated; Datasheet-Link: https://www.diodes.com/assets/Datasheets/ds11108.pdf; Value: BC847B-7-F; DigiKey-PartNum: BC847B-7FDITR-ND; MP: BC847B-7-F; DigiKey-Link: https://www.digikey.com/en/products/detail/diodes-incorporated/BC847B-7-F/1934450?s=N4IgTCBcDaIEIGEAcAWA7HAtGzAxEAugL5A; Price: 0.2; Datasheet: ds11108.pdf
Q9 = SI7611DN-T1-GE3: MOSFET P-CH 40V 18A PPAK1212-8; MF: Vishay Siliconix; Value: SI7611DN-T1-GE3; DigiKey-Link: https://www.digikey.com/product-detail/en/vishay-siliconix/SI7611DN-T1-GE3/SI7611DN-T1-GE3CT-ND/1978912?utm_source=snapeda&utm_medium=aggregator&utm_campaign=symbol; MP: SI7611DN-T1-GE3; Package: PowerPAKÂ®-1212 Vishay; Datasheet: si7611dn.pdf; DigiKey-PartNum: SI7611DN-T1-GE3CT-ND; Datasheet-Link: https://www.vishay.com/docs/69939/si7611dn.pdf; Price: 1.72
Q13 Q15-Q17 = BD140: Bipolar _BJT_ Transistor PNP 80V 1.5A 1.25W Through Hole SOT-32-3; Package: TO-126
R4 R25 R26 R37 R38 R42-R47 R52-R54 R57 R58 R63 R64 R66-R70 R71#1 R71#2 R72 R75-R82 R84 R85 R88 R102 R107-R116 R118 R119 R122 R127 R143-R145 R147-R156 R159 R160 R179 R181 R182 R184 R187 = RC0805FR-070RL: RES SMD 0 OHM JUMPER 1/8W 0805; MF: Yageo; Datasheet-Link: https://www.yageo.com/upload/media/product/productsearch/datasheet/rchip/PYu-RC_Group_51_RoHS_L_11.pdf; DigiKey-PartNum: 311-0.0CRTR-ND; DigiKey-Link: https://www.digikey.com/en/products/detail/yageo/RC0805FR-070RL/2827620?s=N4IgTCBcDaIEoGEAMAOJBWAYnAtEg7EnADIgC6AvkA; MP: RC0805FR-070RL; Price: 0.1; Datasheet: PYu-RC_Group_51_RoHS_L_11.pdf
  R4 R25 R26 R37 R38 R42-R47 R52-R54 R57 R58 R63 R64 R66-R70 R71#1 R71#2 R72 R75-R82 R84 R85 R88 R102 R143 R144 R148-R156 R159 R160 R181 R182 R184 R187: Value: ?
R5-R10 R13 R28 R30 R83 R95 R132 R136 R163 R165 R167 R169 R171 R177 R183 R185 R186 R188 = RC0805FR-071KL: RES SMD 1K OHM 1% 1/8W 0805; MF: Yageo; Datasheet-Link: https://www.yageo.com/upload/media/product/productsearch/datasheet/rchip/PYu-RC_Group_51_RoHS_L_11.pdf; MP: RC0805FR-071KL; DigiKey-Link: https://www.digikey.com/en/products/detail/yageo/RC0805FR-071KL/727444?s=N4IgTCBcDaIEoGEAMAOJBWAYnAtEg7AIwDSAMiALoC%2BQA; DigiKey-PartNum: 311-1.00KCRTR-ND; Price: 0.1; Datasheet: PYu-RC_Group_51_RoHS_L_11.pdf
R11 R12 R23 R24 R34-R36 R39-R41 R176 = CRCW08054K70FKEA: RES SMD 4.7K OHM 1% 1/8W 0805; MF: Vishay Dale; Datasheet-Link: https://www.vishay.com/docs/20035/dcrcwe3.pdf; MP: CRCW08054K70FKEA; DigiKey-Link: https://www.digikey.com/en/products/detail/vishay-dale/CRCW08054K70FKEA/1175713; DigiKey-PartNum: 541-4.70KCTR-ND; Price: 0.1; Datasheet: dcrcwe3.pdf
R15-R22 R27 R31-R33 R56 R60 R62 R65 R73 R106 R123 R125 R128 R131 R135 = RC0805FR-0710KL: 10 kOhms ±1% 0.125W, 1/8W Chip Resistor 0805 (2012 Metric) Moisture Resistant Thick Film; MF: Yageo; Datasheet-Link: https://www.yageo.com/upload/media/product/productsearch/datasheet/rchip/PYu-RC_Group_51_RoHS_L_10.pdf; MP: RC0805FR-0710KL; DigiKey-Link: https://www.digikey.com/product-detail/en/yageo/RC0805FR-0710KL/311-10-0KCRTR-ND/727535; DigiKey-PartNum: 311-10.0KCRTR-ND; Price: 0.00477; Datasheet: PYu-RC_Group_51_RoHS_L_10
R48-R51 R164 R166 R168 R170 = WR08X1000FTL: RES 100 OHM 1% 1/8W 0805; MF: Walsin Technology Corporation; Datasheet-Link: http://www.passivecomponent.com/wp-content/uploads/chipR/ASC_WR.pdf; MP: WR08X1000FTL; DigiKey-Link: https://www.digikey.com/en/products/detail/walsin-technology-corporation/WR08X1000FTL/13241877?s=N4IgTCBcDaIOoCUAMAOAGgRidgYgFQBkQBdAXyA; DigiKey-PartNum: 1292-WR08X1000FTLTR-ND; Price: 0.1; Datasheet: ASC_WR.pdf
R55 R59 R61 = CSR2512A0R01F: RES 0.01 OHM 1% 2W 2512; MF: Riedon; Datasheet-Link: https://riedon.com/media/pdf/CSR.pdf; DigiKey-PartNum: 696-1180-2-ND; DigiKey-Link: https://www.digikey.com/en/products/detail/riedon/CSR2512A0R01F/2813300?s=N4IgTCBcDaIMIGUBKYCsBGMBBADEn6AYiALoC%2BQA; MP: CSR2512A0R01F; Price: 0.67; Datasheet: CSR.pdf
R96 R146 = CRCW080510M0FKEA: RES SMD 10M OHM 1% 1/8W 0805; MF: Vishay Dale; Datasheet-Link: https://www.vishay.com/docs/20035/dcrcwe3.pdf; DigiKey-PartNum: 541-10.0MCTR-ND; DigiKey-Link: https://www.digikey.com/en/products/detail/vishay-dale/CRCW080510M0FKEA/1176130; MP: CRCW080510M0FKEA; Price: 0.1; Datasheet: dcrcwe3.pdf
R97 = RC0805FR-0751KL: RES SMD 51K OHM 1% 1/8W 0805; MF: Yageo; Datasheet-Link: https://www.yageo.com/upload/media/product/productsearch/datasheet/rchip/PYu-RC_Group_51_RoHS_L_11.pdf; DigiKey-PartNum: 311-51.0KCRTR-ND; DigiKey-Link: https://www.digikey.com/en/products/detail/yageo/RC0805FR-0751KL/728013?s=N4IgTCBcDaIEoGEAMAOJBWAYnAtEg7OgIwDSAMiALoC%2BQA; MP: RC0805FR-0751KL; Price: 0.1; Datasheet: PYu-RC_Group_51_RoHS_L_11.pdf
R99 R129 R137 R173 = RC0805FR-0733KL: RES SMD 33K OHM 1% 1/8W 0805; MF: Yageo; Datasheet-Link: https://www.yageo.com/upload/media/product/productsearch/datasheet/rchip/PYu-RC_Group_51_RoHS_L_11.pdf; DigiKey-PartNum: 311-33.0KCRTR-ND; DigiKey-Link: https://www.digikey.com/en/products/detail/yageo/RC0805FR-0733KL/727863?s=N4IgTCBcDaIEoGEAMAOJBWAYnAtEg7AMyEDSAMiALoC%2BQA; MP: RC0805FR-0733KL; Price: 0.1; Datasheet: PYu-RC_Group_51_RoHS_L_11.pdf
R100 R134 = RC0805FR-0722K1L: RES SMD 22.1K OHM 1% 1/8W 0805; MF: Yageo; Datasheet-Link: https://www.yageo.com/upload/media/product/productsearch/datasheet/rchip/PYu-RC_Group_51_RoHS_L_11.pdf; DigiKey-PartNum: 311-22.1KCRTR-ND; DigiKey-Link: https://www.digikey.com/en/products/detail/yageo/RC0805FR-0722K1L/727738?s=N4IgTCBcDaIEoGEAMAOJBWAYnAtEg7GGANICMAMiALoC%2BQA; MP: RC0805FR-0722K1L; Price: 0.1; Datasheet: PYu-RC_Group_51_RoHS_L_11.pdf
R103 = RC0805FR-07226KL: RES SMD 226K OHM 1% 1/8W 0805; MF: Yageo; Datasheet-Link: https://www.yageo.com/upload/media/product/productsearch/datasheet/rchip/PYu-RC_Group_51_RoHS_L_11.pdf; DigiKey-PartNum: 311-226KCRTR-ND; DigiKey-Link: https://www.digikey.com/en/products/detail/yageo/RC0805FR-07226KL/727746?s=N4IgTCBcDaIEoGEAMAOJBWAYnAtEg7GGAGwDSAMiALoC%2BQA; MP: RC0805FR-07226KL; Price: 0.1; Datasheet: PYu-RC_Group_51_RoHS_L_11.pdf
R104 R105 = RC0805FR-0764K9L: RES SMD 64.9K OHM 1% 1/8W 0805; MF: Yageo; Datasheet-Link: https://www.yageo.com/upload/media/product/productsearch/datasheet/rchip/PYu-RC_Group_51_RoHS_L_11.pdf; DigiKey-PartNum: 311-64.9KCRTR-ND; DigiKey-Link: https://www.digikey.com/en/products/detail/yageo/RC0805FR-0764K9L/728090?s=N4IgTCBcDaIEoGEAMAOJBWAYnAtEg7AGwAsA0gJwAyIAugL5A; MP: RC0805FR-0764K9L; Price: 0.1; Datasheet: PYu-RC_Group_51_RoHS_L_11.pdf
R117 = RC0805FR-07200RL: RES SMD 200 OHM 1% 1/8W 0805; MF: Yageo; Datasheet-Link: https://www.yageo.com/upload/media/product/productsearch/datasheet/rchip/PYu-RC_Group_51_RoHS_L_11.pdf; DigiKey-PartNum: 311-200CRTR-ND; DigiKey-Link: https://www.digikey.com/en/products/detail/yageo/RC0805FR-07200RL/727723?s=N4IgTCBcDaIEoGEAMAOJBWAYnAtEg7GEknADIgC6AvkA; MP: RC0805FR-07200RL; Price: 0.1; Datasheet: PYu-RC_Group_51_RoHS_L_11.pdf
R120 = RT0805BRD07301KL: RES SMD 301K OHM 0.1% 1/8W 0805; MF: Yageo; Datasheet-Link: https://www.yageo.com/upload/media/product/productsearch/datasheet/rchip/PYu-RT_1-to-0.01_RoHS_L_12.pdf; MP: RT0805BRD07301KL; DigiKey-Link: https://www.digikey.com/en/products/detail/yageo/RT0805BRD07301KL/1075802?s=N4IgTCBcDaIEoBUAMAOJBWAQnAIkg7AMxICMA0gDIgC6AvkA; DigiKey-PartNum: YAG4880TR-ND; Price: 0.36; Datasheet: PYu-RT_1-to-0.01_RoHS_L_12.pdf
R121 = RC0805FR-0795K3L: RES SMD 95.3K OHM 1% 1/8W 0805; MF: Yageo; Datasheet-Link: https://www.yageo.com/upload/media/product/productsearch/datasheet/rchip/PYu-RC_Group_51_RoHS_L_11.pdf; DigiKey-PartNum: 311-95.3KCRTR-ND; DigiKey-Link: https://www.digikey.com/en/products/detail/yageo/RC0805FR-0795K3L/728209?s=N4IgTCBcDaIEoGEAMAOJBWAYnAtEg7AJzoDSAzADIgC6AvkA; MP: RC0805FR-0795K3L; Price: 0.1; Datasheet: PYu-RC_Group_51_RoHS_L_11.pdf
R124 R130 = PA2512FKF7W0R004E: RES 0.004 OHM 1% 2W 2512; MF: Yageo; DigiKey-PartNum: YAG2144TR-ND; MP: PA2512FKF7W0R004E; populate: *; Datasheet-Link: https://www.yageo.com/upload/media/product/productsearch/datasheet/rchip/PYu-PA_E_51_RoHS_10.pdf; DigiKey-Link: https://www.digikey.com/en/products/detail/yageo/PA2512FKF7W0R004E/5138663?s=N4IgTCBcDaIAoEEwFYCMYBiBpDB2A6gAwBKhhALAKIgC6AvkA; Price: 0.73; Datasheet: PYu-PA_E_51_RoHS_10.pdf
R126 R138 = RC1206FR-0710RL: RES SMD 10 OHM 1% 1/4W 1206; MF: Yageo; Datasheet-Link: https://www.yageo.com/upload/media/product/productsearch/datasheet/rchip/PYu-RC_Group_51_RoHS_L_11.pdf; DigiKey-PartNum: 311-10.0FRTR-ND; DigiKey-Link: https://www.digikey.com/en/products/detail/yageo/RC1206FR-0710RL/728482?s=N4IgTCBcDaIEoGECMYAMA2AYnAtKg7EqnADIgC6AvkA; MP: RC1206FR-0710RL; Price: 0.15; Datasheet: PYu-RC_Group_51_RoHS_L_11.pdf
R133 R172 R174 = RC0805FR-0788K7L: RES SMD 88.7K OHM 1% 1/8W 0805; MF: Yageo; Datasheet-Link: https://www.yageo.com/upload/media/product/productsearch/datasheet/rchip/PYu-RC_Group_51_RoHS_L_11.pdf; DigiKey-PartNum: 311-88.7KCRTR-ND; DigiKey-Link: https://www.digikey.com/en/products/detail/yageo/RC0805FR-0788K7L/728181?s=N4IgTCBcDaIEoGEAMAOJBWAYnAtEg7CigNL4AyIAugL5A; MP: RC0805FR-0788K7L; Price: 0.1; Datasheet: PYu-RC_Group_51_RoHS_L_11.pdf
R139 R141 R142 R178 R? = CRCW0805100KFKEA: RES SMD 100K OHM 1% 1/8W 0805; MF: Vishay Dale; Datasheet-Link: https://www.vishay.com/docs/20035/dcrcwe3.pdf; DigiKey-PartNum: 541-100KCTR-ND; DigiKey-Link: https://www.digikey.com/en/products/detail/vishay-dale/CRCW0805100KFKEA/1175865; MP: CRCW0805100KFKEA; Price: 0.1; Datasheet: dcrcwe3.pdf
R157 R158 R161 R162 = CRCW0805470RFKEAC: RES 470 OHM 1% 1/8W 0805; MF: Vishay Dale; Datasheet-Link: https://www.vishay.com/docs/28773/crcwce3.pdf; MP: CRCW0805470RFKEAC; DigiKey-Link: https://www.digikey.com/en/products/detail/vishay-dale/CRCW0805470RFKEAC/7928569?s=N4IgTCBcDaIMICU4HUAMAOVBWALAdlQQDEBpAUQEE4QBdAXyA; DigiKey-PartNum: 541-4147-2-ND; Price: 0.1; Datasheet: crcwce3.pdf
R175 = RC0805JR-0743KL: RES SMD 43K OHM 5% 1/8W 0805; MF: Yageo; Datasheet-Link: https://www.yageo.com/upload/media/product/productsearch/datasheet/rchip/PYu-RC_Group_51_RoHS_L_11.pdf; MP: RC0805JR-0743KL; DigiKey-Link: https://www.digikey.com/en/products/detail/yageo/RC0805JR-0743KL/728332?s=N4IgTCBcDaIEoGEAMAOJBWAUnAtEg7ACwDMA0gDIgC6AvkA; DigiKey-PartNum: 311-43KARTR-ND; Price: 0.1; Datasheet: PYu-RC_Group_51_RoHS_L_11.pdf
R180 = ERJ-6ENF2204V: RES SMD 2.2M OHM 1% 1/8W 0805; MF: Panasonic Electronic Components; Datasheet-Link: https://industrial.panasonic.com/cdbs/www-data/pdf/RDA0000/AOA0000C304.pdf; MP: ERJ-6ENF2204V; DigiKey-Link: https://www.digikey.com/en/products/detail/panasonic-electronic-components/ERJ-6ENF2204V/282717?s=N4IgTCBcDaIKICUBSBaAbHAcgMTGADACwBqIAugL5A; DigiKey-PartNum: P2.20MCTR-ND; Price: 0.1; Datasheet: AOA0000C304.pdf
RN1 RN3 = TC164-JR-0747RL: 47 Ohm ±5% 62.5mW Power Per Element Isolated 4 Resistor Network/Array ±200ppm/°C 1206 (3216 Metric), Concave, Long Side Terminals; MF: Yageo; Package: 1206; Price: 0.13; MP: TC164-JR-0747RL; Datasheet: PYu-YC_TC_group_51_RoHS_L_9.pdf; Datasheet-Link: https://www.yageo.com/upload/media/product/productsearch/datasheet/rchip/PYu-YC_TC_group_51_RoHS_L_9.pdf; DigiKey-Link: https://www.digikey.com/en/products/detail/yageo/TC164-JR-0747RL/1004810?s=N4IgTCBcDaICoGECMA2ALAWgFICUMAYB2NQnAGRAF0BfIA; DigiKey-PartNum: TC164J-47TR-ND
RN2 = TC164-JR-0710KL: RES ARRAY 4 RES 10K OHM 1206; MF: Yageo; Package: 1206; Price: 0.13; MP: TC164-JR-0710KL; Datasheet: PYu-YC_TC_group_51_RoHS_L_9.pdf; Datasheet-Link: https://www.yageo.com/upload/media/product/productsearch/datasheet/rchip/PYu-YC_TC_group_51_RoHS_L_9.pdf; DigiKey-Link: https://www.digikey.com/en/products/detail/yageo/TC164-JR-0710KL/1004841?s=N4IgTCBcDaICoGECMA2ALAWgFICUMAYB2JfAaQBkQBdAXyA; DigiKey-PartNum: TC164J-10KTR-ND
SJ1 SJ2 = JUMP_3: 3 (1 x 3) Position Shunt Connector Black Open Top
U3 U5 = TMP75AIDR: SENSOR DIGITAL -40C-125C 8SOIC; MF: Texas Instruments; LCSC-PartNum: 296-17838-2-ND; LCSC-Link: https://www.digikey.com/en/products/detail/texas-instruments/TMP75AIDR/736070; MP: TMP75AIDR; Value: TMP75AIDR; Datasheet-Link: https://www.ti.com/lit/ds/symlink/tmp175.pdf?HQS=dis-dk-null-digikeymode-dsf-pf-null-wwe&ts=1619235878497; Price: 1.06; Datasheet: tmp175.pdf
U4 = MK22FN1M0AVLQ12: ARMÂ® CortexÂ®-M4 Kinetis K20 Microcontroller IC 32-Bit 120MHz 1MB _1M x 8_ FLASH 144-LQFP _20x20_; MF: NXP USA; MP: MK22FN1M0AVLQ12; DigiKey-PartNum: MK22FN1M0AVLQ12-ND; Package: LQFP-144 NXP Semiconductors; DigiKey-Link: https://www.digikey.co.th/product-detail/en/nxp-usa-inc/MK22FN1M0AVLQ12/MK22FN1M0AVLQ12-ND/5154711?utm_source=snapeda&utm_medium=aggregator&utm_campaign=symbol; Value: MK22FN1M0AVLQ12; Datasheet-Link: https://www.mouser.com/datasheet/2/302/K22P144M120SF5V2-1126117.pdf; Datasheet: K22P144M120SF5V2-1126117.pdf; Price: 17.23
U7 = TMP75AIDR: SENSOR; MF: Texas Instruments; LCSC-PartNum: 296-17838-2-ND; LCSC-Link: https://www.digikey.com/en/products/detail/texas-instruments/TMP75AIDR/736070; MP: TMP75AIDR; Value: TMP75AIDR; Datasheet-Link: https://www.ti.com/lit/ds/symlink/tmp175.pdf?HQS=dis-dk-null-digikeymode-dsf-pf-null-wwe&ts=1619235878497; Price: 1.06; Datasheet: tmp175.pdf
U8 = XB3-24Z8UM-J: 802.15.4 ZigbeeÂ® Transceiver Module 2.4GHz Antenna Not Included, U.FL Surface Mount; MF: Digi International; Datasheet: ds_xbee-3-zigbee-3; MP: XB3-24Z8UM-J; Value: XB3-24Z8UM-J; DigiKey-Link: https://www.digikey.com/en/products/detail/digi/XB3-24Z8UM/7688712; Price: 20.89; Package: SMD-34 Digi International; Datasheet-Link: https://www.digi.com/resources/library/data-sheets/ds_xbee-3-zigbee-3; DigiKey-PartNum: 602-2131-ND
U9-U11 = DRV8703QRHBTQ1: Automotive 45-V H-bridge smart gate driver with SPI control 32-VQFN -40 to 125; MF: Texas Instruments; Value: DRV8703QRHBTQ1; MP: DRV8703QRHBTQ1; DigiKey-Link: https://www.digikey.com/en/products/detail/texas-instruments/DRV8703QRHBTQ1/13448800; Datasheet-Link: https://rocelec.widen.net/view/pdf/car3djjhle/drv8702-q1.pdf?t.download=true&u=5oefqw; Package: VQFN-32 Texas Instruments; DigiKey-PartNum: 296-48127-1-ND; Datasheet: drv8702-q1; Price: 2.92
U12-U23 = JMTK50N06A: MOSFET DIP JMTK50N06A N-ch 60V 50A TO-252,Jie Jie Micro; Value: MOSFET-N; DigiKey-Link: https://connectortrade.dk/component/jmtk50n06a/8445227/; Datasheet-Link: http://www.jjadw.com/upfile/file/2020/06/30/15934974612577466.pdf; Price: 0.01; MP: JMTK50N06A; MF: JIE JIE MICRO; DigiKey-PartNum: JMTK50N06A; ComponentLink1Description: Manufacturer Link; ComponentLink1URL: http://www.irf.com/; Datasheet: 15934974612577466.pdf
U27 U33 = TPS560430XFDBVT: IC REG BUCK PWM 600MA SOT23-6; MF: Texas Instruments; Datasheet-Link: https://www.ti.com/general/docs/suppproductinfo.tsp?distId=10&gotoUrl=http%3A%2F%2Fwww.ti.com%2Flit%2Fgpn%2Ftps560430; Lcsc-Link: https://www.digikey.com/en/products/detail/texas-instruments/TPS560430XFDBVT/9094604?s=N4IgTCBcDaICoAUDKBWAbABgCwGYMA0AxAEQCEA1OEAXQF8g; MP: TPS560430XFDBVT; Lcsc-PartNum: 296-50421-2-ND; Price: 1.45; Value: TPS560430XFDBVT; Datasheet: tps560430.pdf
U29 = LTC4015EUHF#PBF: Charger IC Multi-Chemistry 38-QFN (5x7); MF: Analog Devices; Price: 12.58; Datasheet-Link: https://www.analog.com/media/en/technical-documentation/data-sheets/4015fb.pdf; MP: LTC4015EUHF#PBF; Datasheet: 4015fb.pdf; Value: LTC4015EUHF#PBF; Package: QFN -38 Analog Devices; DigiKey-Link: https://www.digikey.com/en/products/detail/analog-devices-inc/LTC4015EUHF-PBF/5361644?s=N4IgTCBcDaIDIBUDCAWADARgKwFECqAEgGIDEACgEJEgC6AvkA; DigiKey-PartNum: LTC4015EUHF#PBF-ND
U35 = TL431ACDBZR: Shunt Voltage Reference IC 36V Â±1% SOT-23-3; MF: Texas Instruments; Value: TL431ACDBZR; Datasheet-Link: https://www.ti.com/lit/ds/symlink/tl431.pdf?HQS=dis-dk-null-digikeymode-dsf-pf-null-wwe&ts=1619235490409; MP: TL431ACDBZR; Datasheet: tl431.pdf; Price: 0.41; Package: SOT-23-3 Nexperia; DigiKey-Link: https://www.digikey.com/en/products/detail/texas-instruments/TL431ACDBZR/686855; DigiKey-PartNum: 296-17328-2-ND
Y1 = ABM3B-8.000MHZ-B2-T: 8MHz Â±20ppm Crystal 18pF 200 Ohms 4-SMD, No Lead; MF: Abracon LLC; Datasheet-Link: https://abracon.com/Resonators/abm3b.pdf; Price: 0.95; MP: ABM3B-8.000MHZ-B2-T; Value: 8MHz; Datasheet: abm3b.pdf; Package: SMD-4 Abracon LLC; DigiKey-Link: https://www.digikey.com/en/products/detail/abracon-llc/ABM3B-8-000MHZ-B2-T/1873166?s=N4IgTCBcDaIIICECyBmBBaAHAOgAz6QAkAtdBMdAFRAF0BfIA; DigiKey-PartNum: 535-9720-2-ND
Y2 = ABS07-32.768KHZ-T: CRYSTAL 32.7680KHZ 12.5PF 2-SMD; MF: Abracon LLC; MP: ABS07-32.768KHZ-T; Datasheet-Link: https://abracon.com/Resonators/ABS07.pdf; DigiKey-PartNum: 535-9542-2-ND; DigiKey-Link: https://www.digikey.com/en/products/detail/abracon-llc/ABS07-32-768KHZ-T/1236858?s=N4IgTCBcDaIIICEDKAGA7AWgMxgHRoDYAOAaQAkAtDAFRAF0BfIA; Price: 2.36; Datasheet: ABS07.pdf